# EAGLE design 12v_converter (EAGLE 7.2.0)
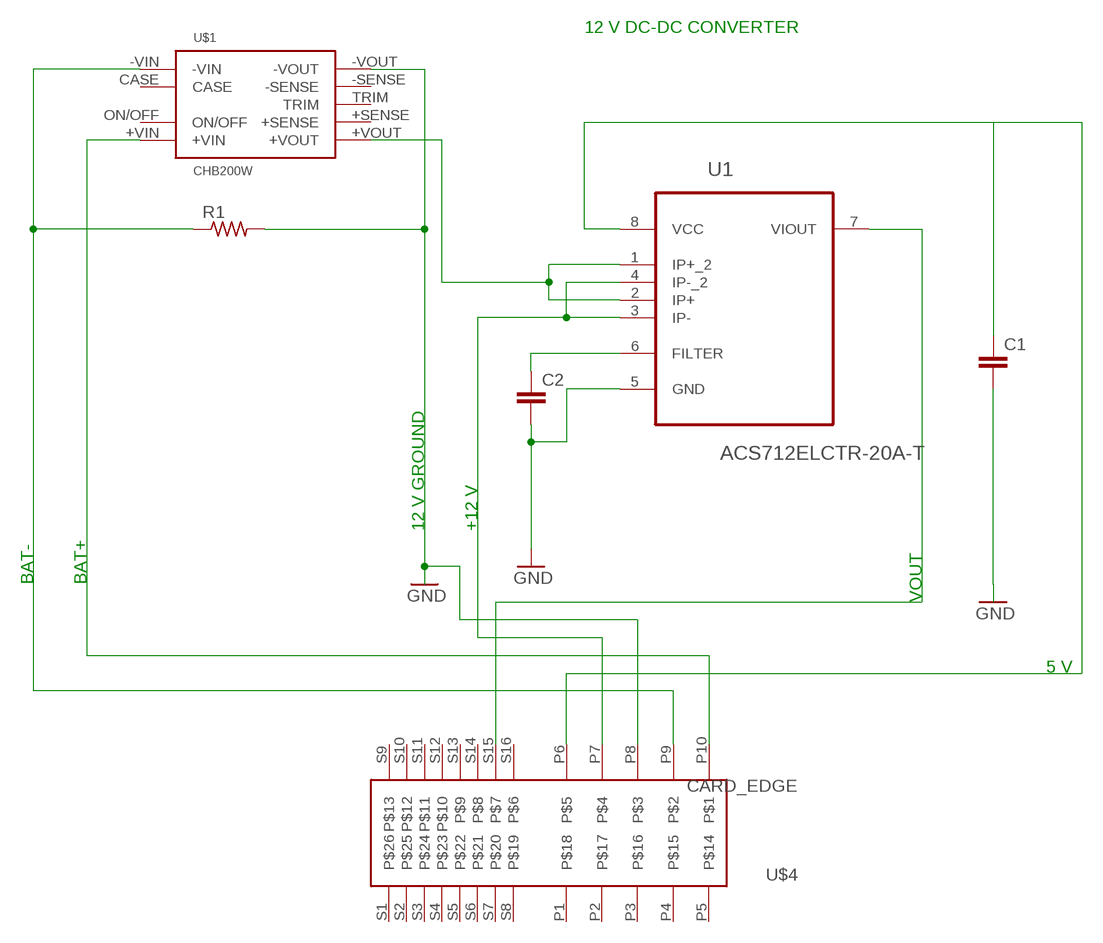
[diagram p0: schematic, sheet 1]

## Parts
C1  C-EU025-024X044  [C025-024X044]
C2  C-EU025-024X044  [C025-024X044]
R1  R-US_0204/2V  [0204V]
U1  ACS712ELCTR-20A-T  [SOIC127P600X175-8N]
U$1  CHB200W  [CHB200W-24S12]
U$4  CARD_EDGE  [EDGE_CONNECTOR]

## Nets
GND: C1.2 C2.2 R1.2 U1.5(GND) U$1.-VOUT U$4.P8
N$1: U1.1(IP+_2) U1.2(IP+) U$1.+VOUT
N$2: U$1.+VIN U$4.P10
N$3: R1.1 U$1.-VIN U$4.P9
N$4: U1.3(IP-) U1.4(IP-_2) U$4.P7
N$5: U1.7(VIOUT) U$4.S15
N$6: C1.1 U1.8(VCC) U$4.P6
N$7: C2.1 U1.6(FILTER)
Unconnected: U$1.+SENSE U$1.-SENSE U$1.CASE U$1.ON/OFF U$1.TRIM U$4.P1 U$4.P2 U$4.P3 U$4.P4 U$4.P5 U$4.S1 U$4.S2 U$4.S3 U$4.S4 U$4.S5 U$4.S6 U$4.S7 U$4.S8 U$4.S9 U$4.S10 U$4.S11 U$4.S12 U$4.S13 U$4.S14 U$4.S16

## Notes on the sheet
- 12 V DC-DC CONVERTER
- 12 V GROUND | +12 V
- BAT- | BAT+
- VOUT
- 5 V

## Library data of the parts
C1 C2 = rcl:C-EU: CAPACITOR, European symbol
R1 = resistor:R-US_: RESISTOR, American symbol
U1 = Allegro_By_element14_Batch_1:ACS712ELCTR-20A-T: Linear Current Sensor; MPN: ACS712ELCTR-20A-T; OC_FARNELL: 1329624; OC_NEWARK: 31M3133; PACKAGE: SOIC-8; SUPPLIER: Allegro
U$1 = CINCON DC-DC CONVERTER:CHB200W
U$4 = Molex_Edge:CARD_EDGE

## Board
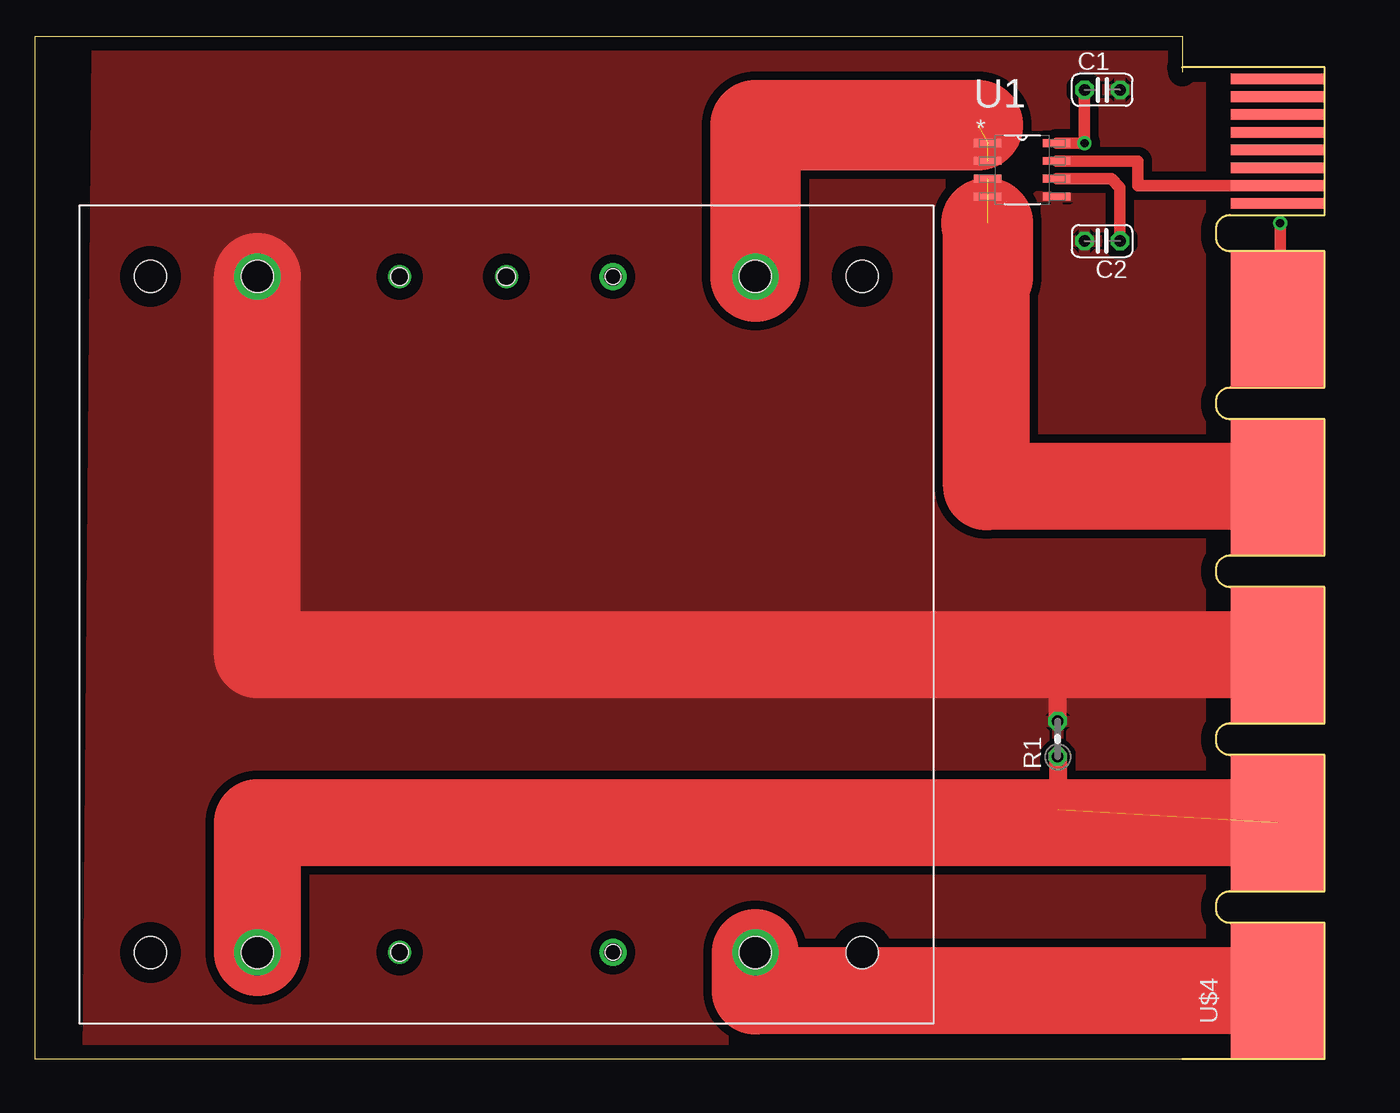
[diagram p1: board, top side]
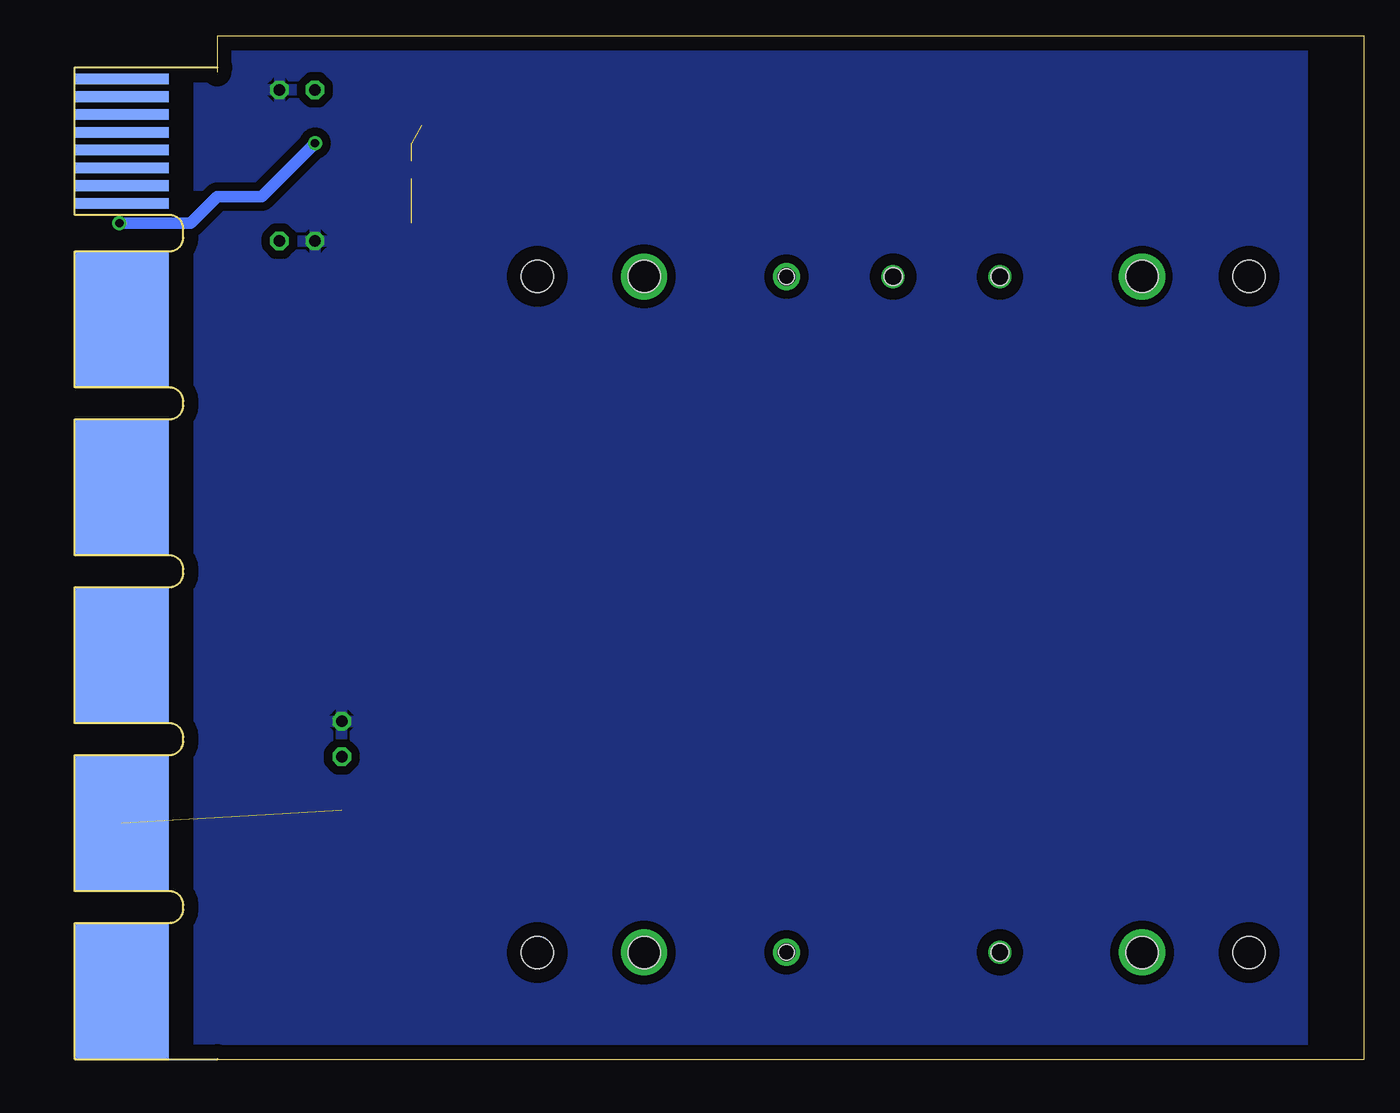
[diagram p2: board, bottom side, seen from below]

Size 92.08 x 73.02 mm. Coordinates in mm from the lower left corner, seen from the top.
Outline: 81.92,0 0,0 0,73.02 81.92,73.02 81.92,70.48
Copper layers (1*16): Top 0.035mm / dielectric 1.5mm / Bottom 0.035mm
Design rules "default": minimum track width 10mil, minimum drill 24mil, track to track 8mil, track to pad 8mil, pad to pad 8mil, via to via 8mil, smd to smd 8mil, copper to edge 40mil, drill to drill 8mil, minimum pad ring 10mil, minimum via ring 8mil, stop-mask expansion 4mil, vias tented up to drill 0mil, thermal gap 10mil

### Footprints (pad centres in the part's own frame; a part is rotated, then mirrored left to right if it is on the bottom)
C025-024X044 = drill 0.813 octagon: 1 -1.27,0; 2 1.27,0
0204V = drill 0.813 octagon: 1 -1.27,0; 2 1.27,0
SOIC127P600X175-8N = smd 1.981 x 0.559: 1 -2.464,1.905; 2 -2.464,0.635; 3 -2.464,-0.635; 4 -2.464,-1.905; 5 2.464,-1.905; 6 2.464,-0.635; 7 2.464,0.635; 8 2.464,1.905
CHB200W-24S12 = drill 1.27: +SENSE 48.26,17.78; ON/OFF 0,17.78 | drill 2.286: +VIN 0,7.62; +VOUT 48.26,7.62; -VIN 0,43.18; -VOUT 48.26,43.18 | drill 1.1: -SENSE 48.26,33.02; CASE 0,33.02; TRIM 48.26,25.4 | hole 2.286: 0,0; 48.26,0; 0,7.62; 0,50.8; 0,43.18; 48.26,7.62; 48.26,43.18; 48.26,50.8 | hole 1.1: 0,17.78; 48.26,17.78 | hole 1.27: 0,33.02; 48.26,33.02; 48.26,25.4
EDGE_CONNECTOR = smd 9.728 x 6.706 bottom: P1 52.87,3.35; P2 40.87,3.35; P3 28.87,3.35; P4 16.87,3.35 | smd 9.73 x 6.7 bottom: P5 4.87,3.35 | smd 9.728 x 6.706: P6 52.87,3.35; P7 40.87,3.35; P8 28.87,3.35; P9 16.87,3.35 | smd 9.73 x 6.7: P10 4.87,3.35 | smd 0.76 x 6.7 bottom: S1 69.99,3.35; S2 68.72,3.35; S3 67.45,3.35; S4 66.18,3.35; S5 64.91,3.35; S6 63.64,3.35; S7 62.37,3.35; S8 61.1,3.35 | smd 0.76 x 6.7: S9 69.99,3.35; S10 68.72,3.35; S11 67.45,3.35; S12 66.18,3.35; S13 64.91,3.35; S14 63.64,3.35; S15 62.37,3.35; S16 61.1,3.35

### Placement (x,y rotation side)
C1  76.2,69.22 0 top
C2  76.2,58.42 180 top
R1  73.03,22.86 90 top
U1  70.48,63.5 0 top
U$1  59.06,7.62 90 top
U$4  92.08,0 90 top

### Tracks (layer width: path | path; a pad name or v marks a point on that pad's centre or on a via)
GND
  Top 1.27: R1.2 73.03,26.67 71.75,26.67
  Top 6.198: U$4.P8 15.88,28.87 U$1.-VOUT
  pour Top (isolate 0.61): 4.44,72.39 83.19,72.39 83.19,0 3.81,0
  pour Bottom (isolate 0.61): 4.44,72.39 83.19,72.39 83.19,0 4.44,0
N$1  (2 unrouted)
  Top 6.452: U$1.+VOUT 51.44,66.67 67.31,66.67
N$2
  Top 6.198: U$4.P10 51.44,4.87 U$1.+VIN
N$3  (1 unrouted)
  Top 1.27: R1.1 73.03,17.78
  Top 6.198: U$4.P9 15.88,16.87 U$1.-VIN
N$4  (2 unrouted)
  Top 2.54: 67.95,55.88 68.02,55.88
  Top 6.198: U$4.P7 67.95,40.87 67.95,55.88
  Top 6.452: 68.02,55.88 68.02,59.69 67.95,59.69
N$5
  Top 0.813: U$4.S15 78.74,62.37 78.74,64.13 U1.7
N$6  (via drill 0.6)
  Top 0.813: C1.1 v74.93,65.41 U1.8 | v88.9,59.69 88.9,53.34 U$4.P6
  Bottom 0.813: v74.93,65.41 78.74,61.59 81.92,61.59 83.82,59.69 v88.9,59.69
N$7
  Top 0.813: C2.1 77.47,62.23 76.83,62.86 U1.6